# Altium project MOTORCONTROL.BLDC.REGENBRAKING.PrjPcb
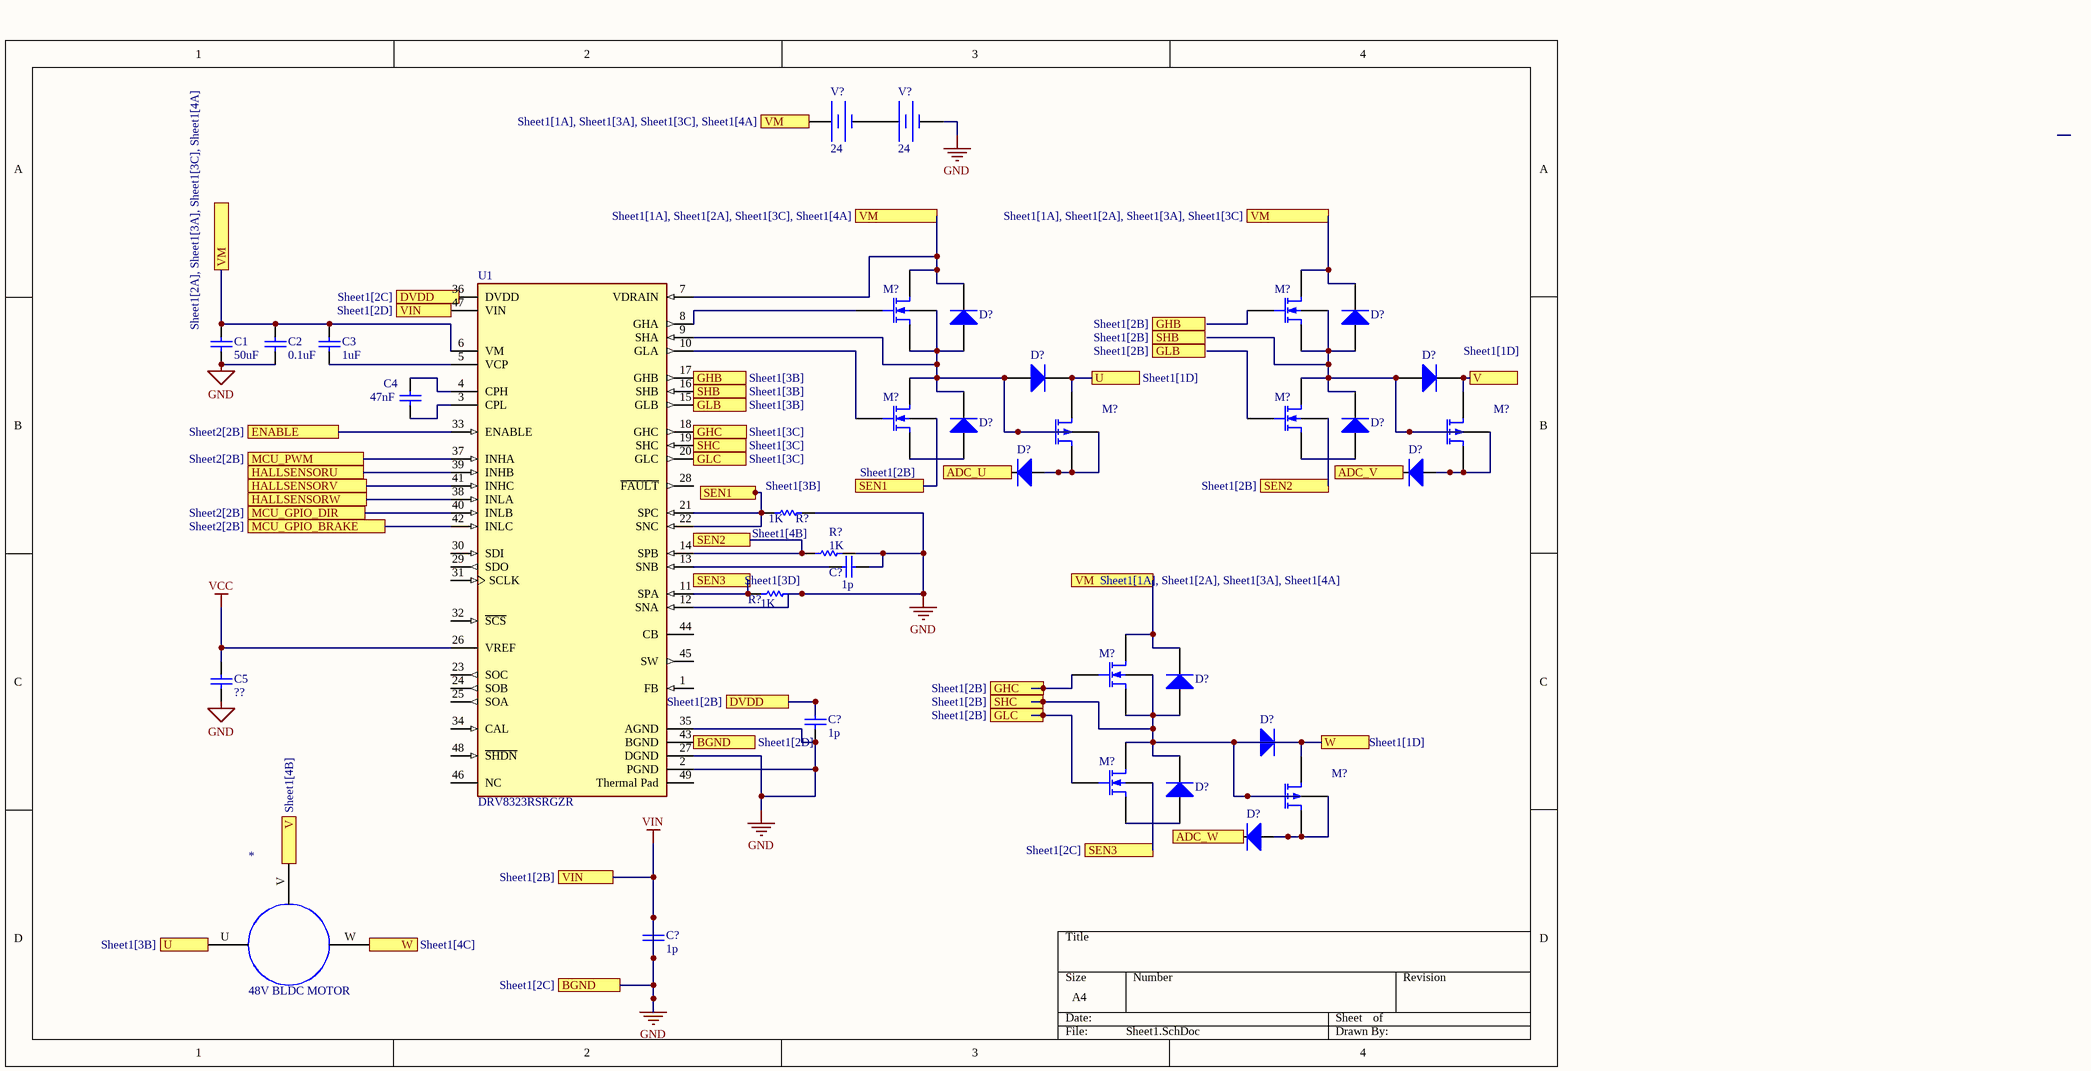
[diagram p0: Sheet1.SchDoc]
2 sheets, 37 parts. Net scope: flat (ports and power ports of the same name join across sheets).
Sheets:
  Sheet1.SchDoc
  Sheet2.SchDoc

## Sheet Sheet1.SchDoc
size A4; SheetNumber: 1; SheetTotal: 1

### Parts
(Parts that share a designator on the sheet are numbered #1, #2 ... from top to bottom, then left to right.)
*  48V BLDC MOTOR
C1  value 50uF  (hidden comment: Capacitor)
C2  value 0.1uF  (hidden comment: Capacitor)
C3  value 1uF  (hidden comment: Capacitor)
C4  value 47nF  (hidden comment: Capacitor)
C5  value ??  (hidden comment: Capacitor)
C?#1  value 1p  (hidden comment: Capacitor)
C?#2  value 1p  (hidden comment: Capacitor)
C?#3  value 1p  (hidden comment: Capacitor)
D?#1  Diode  (value not drawn)
D?#2  Diode  (value not drawn)
D?#3  Diode  (value not drawn)
D?#4  Diode  (value not drawn)
D?#5  Diode  (value not drawn)
D?#6  Diode  (value not drawn)
D?#7  Diode  (value not drawn)
D?#8  Diode  (value not drawn)
D?#9  Diode  (value not drawn)
D?#10  Diode  (value not drawn)
D?#11  Diode  (value not drawn)
D?#12  Diode  (value not drawn)
M?#1  N-channel MOSFET MOS9 Model  (value not drawn)
M?#2  N-channel MOSFET MOS9 Model  (value not drawn)
M?#3  N-channel MOSFET MOS9 Model  (value not drawn)
M?#4  N-channel MOSFET MOS9 Model  (value not drawn)
M?#5  P-channel MOS1 MOSFET Shichman and Hodges Model  (value not drawn)
M?#6  P-channel MOS1 MOSFET Shichman and Hodges Model  (value not drawn)
M?#7  N-channel MOSFET MOS9 Model  (value not drawn)
M?#8  N-channel MOSFET MOS9 Model  (value not drawn)
M?#9  P-channel MOS1 MOSFET Shichman and Hodges Model  (value not drawn)
R?#1  value 1K  (hidden comment: Resistor)
R?#2  value 1K  (hidden comment: Resistor)
R?#3  value 1K  (hidden comment: Resistor)
U1  DRV8323RSRGZR  [FP-RGZ0048A-IPC_A]
V?#1  DC Magnitude: 24  (hidden comment: Constant Voltage Source)
V?#2  DC Magnitude: 24  (hidden comment: Constant Voltage Source)

### Ports
ADC_U, ADC_V, ADC_W, BGND (see Sheet1[2C]), BGND (see Sheet1[2D]), DVDD (see Sheet1[2B]), DVDD (see Sheet1[2C]), ENABLE (see Sheet2[2B]), GHB (see Sheet1[2B]), GHB (see Sheet1[3B]), GHC (see Sheet1[2B]), GHC (see Sheet1[3C]), GLB (see Sheet1[2B]), GLB (see Sheet1[3B]), GLC (see Sheet1[2B]), GLC (see Sheet1[3C]), HALLSENSORU, HALLSENSORV, HALLSENSORW, MCU_GPIO_BRAKE (see Sheet2[2B]), MCU_GPIO_DIR (see Sheet2[2B]), MCU_PWM (see Sheet2[2B]), SEN1 (see Sheet1[2B]), SEN1 (see Sheet1[3B]), SEN2 (see Sheet1[2B]), SEN2 (see Sheet1[4B]), SEN3 (see Sheet1[2C]), SEN3 (see Sheet1[3D]), SHB (see Sheet1[2B]), SHB (see Sheet1[3B]), SHC (see Sheet1[2B]), SHC (see Sheet1[3C]), U (see Sheet1[1D]), U (see Sheet1[3B]), V (see Sheet1[1D]), V (see Sheet1[4B]), VIN (see Sheet1[2B]), VIN (see Sheet1[2D]), VM (see Sheet1[1A], Sheet1[2A], Sheet1[3A], Sheet1[3C]), VM (see Sheet1[1A], Sheet1[2A], Sheet1[3A], Sheet1[4A]), VM (see Sheet1[1A], Sheet1[2A], Sheet1[3C], Sheet1[4A]), VM (see Sheet1[1A], Sheet1[3A], Sheet1[3C], Sheet1[4A]), VM (see Sheet1[2A], Sheet1[3A], Sheet1[3C], Sheet1[4A]), W (see Sheet1[1D]), W (see Sheet1[4C])

### Nets
GND: C1.1 C2.1 C5.1 C?#1.2 C?#2.1 C?#3.1 C?#3.2 R?#1.2 R?#2.2 R?#3.2 U1.2(PGND) U1.12(SNA) U1.27(DGND) U1.35(AGND) U1.43(BGND) U1.47(VIN) V?#2.2 ; port BGND, port VIN  [also labelled VIN]
VCC: C5.2 U1.26(VREF)
NetC1_2: C1.2 C2.2 C3.2 D?#1.2(K) D?#2.2(K) D?#9.2(K) M?#1.1(D) M?#2.1(D) M?#7.1(D) U1.6(VM) U1.7(VDRAIN) V?#1.1 ; port VM
NetC3_1: C3.1 U1.5(VCP)
NetC4_1: C4.1 U1.3(CPL)
NetC4_2: C4.2 U1.4(CPH)
NetC?#1_1: C?#1.1 U1.13(SNB)
NetC?#2_2: C?#2.2 ; port DVDD
NetD?#1_1: D?#1.1(A) D?#3.1(A) D?#5.2(K) M?#1.3(S) M?#1.4(B) M?#3.1(D) M?#5.2(G) U1.9(SHA)
NetD?#2_1: D?#2.1(A) D?#4.1(A) D?#6.2(K) M?#2.3(S) M?#2.4(B) M?#4.1(D) M?#6.2(G)
NetD?#3_2: D?#3.2(K) M?#5.1(D) ; port U
NetD?#4_2: D?#4.2(K) M?#6.1(D) ; port V
NetD?#5_1: D?#5.1(A) M?#3.3(S)
NetD?#6_1: D?#6.1(A) M?#4.3(S)
NetD?#7_1: D?#7.1(A) M?#5.3(S) M?#5.4(B)
NetD?#8_1: D?#8.1(A) M?#6.3(S) M?#6.4(B)
NetD?#9_1: D?#9.1(A) D?#10.1(A) D?#10.2(K) D?#11.2(K) M?#7.3(S) M?#7.4(B) M?#8.1(D) M?#9.1(D) M?#9.2(G) U1.19(SHC) ; port SHC, port W
NetD?#11_1: D?#11.1(A) M?#8.3(S)
NetD?#12_1: D?#12.1(A) M?#9.3(S) M?#9.4(B)
NetM?#1_2: M?#1.2(G) U1.8(GHA)
NetM?#3_2: M?#3.2(G) U1.10(GLA)
NetM?#3_4: M?#3.4(B) R?#1.1 U1.21(SPC) U1.22(SNC) ; port SEN1
NetM?#4_4: M?#4.4(B) R?#2.1 U1.14(SPB) ; port SEN2
NetM?#7_2: M?#7.2(G) U1.18(GHC) ; port GHC
NetM?#8_2: M?#8.2(G) U1.20(GLC) ; port GLC
NetM?#8_4: M?#8.4(B) R?#3.1 U1.11(SPA) ; port SEN3
NetU1_15: U1.15(GLB) ; port GLB
NetU1_16: U1.16(SHB) ; port SHB
NetU1_17: U1.17(GHB) ; port GHB
NetU1_33: U1.33(ENABLE) ; port ENABLE
NetU1_37: U1.37(INHA) ; port MCU_PWM
NetU1_38: U1.38(INLA) ; port HALLSENSORW
NetU1_39: U1.39(INHB) ; port HALLSENSORU
NetU1_40: U1.40(INLB) ; port MCU_GPIO_DIR
NetU1_41: U1.41(INHC) ; port HALLSENSORV
NetU1_42: U1.42(INLC) ; port MCU_GPIO_BRAKE
NetV?#1_2: V?#1.2 V?#2.1

Not connected (* = marked no-connect by the designer): * U(25) V(U) W(26); D?#7 2(K); D?#8 2(K); D?#12 2(K); M?#2 2(G); M?#4 2(G); U1 1(FB) 23(SOC) 24(SOB) 25(SOA) 28(~{FAULT}) 29(SDO) 30(SDI) 31(SCLK) 32(~{SCS}) 34(CAL) 36(DVDD) 44(CB) 45(SW) 46(NC) 48(~{SHDN}) 49(Thermal_Pad)

### Library data of the parts
C1-C5 C?#1-C?#3 = Capacitor: SimulationGenericComponent: True
D?#1-D?#12 = Diode: AF: 1; BV: 0; BV_MAX: 1e99; EG: 1.11; FC: 0.5; IBV: 0.001; ISR: 1e-14; MJSW: 0.33; NTUN: 30; TNOM: 27; XTI: 3; SimulationGenericComponent: True; CJO: 0; CJP: 0; CTA: 0; CTP: 0; FCS: 0.5; FV_MAX: 1e99; IKF: 0; IKR: 0; JSW: 0; JTUN: 0; JTUNSW: 0; KEG: 1; KF: 0; LEVEL: 1; N: 1; NBV: 1; NR: 1; NS: 1; PHP: 1; RS: 0; TCV: 0; TLEV: 0; TLEVC: 0; TM1: 0; TM2: 0; TPB: 0; TPHP: 0; TRS: 0; TRS2: 0; TT: 0; TTT1: 0; TTT2: 0; VJ: 1; XTITUN: 3; IS: 1e-14
M?#1-M?#4 M?#7 M?#8 = MOSFET N-ch Lev9: AF: 1; ALPHA: 0; FC: 0.5; IS: 1e-14; KAPPA: 0.2; KP: 2.07189e-05; MJSW: 0.33; PB: 0.8; PHI: 0.6; TNOM: 27; TOX: 1e-07; U0: 600; SimulationGenericComponent: True; CBD: 0; CBS: 0; CGBO: 0; CGDO: 0; CGSO: 0; CJ: 0; CJSW: 0; DELTA: 0; DELVTO: 0; ETA: 0; GAMMA: 0; INPUT_DELTA: 0; JS: 0; KF: 0; LD: 0; MJ: 0.5; NFS: 0; NSS: 0; NSUB: 0; RD: 0; RS: 0; RSH: 0; THETA: 0; TPG: 0; VMAX: 0; VTO: 0; WD: 0; XD: 0; XJ: 0; XL: 0; XW: 0
M?#5 M?#6 M?#9 = MOSFET P-ch Lev1: CBD: 0; FC: 0.5; IS: 1e-14; KP: 2e-05; PB: 0.8; PHI: 0.6; TNOM: 27; SimulationGenericComponent: True; CBS: 0; CGBO: 0; CGDO: 0; CGSO: 0; CJ: 0; CJSW: 0; GAMMA: 0; JS: 0; LAMBDA: 0; LD: 0; MJ: 0.5; MJSW: 0.5; NSS: 0; NSUB: 0; RD: 0; RS: 0; RSH: 0; TOX: 0; TPG: 0; U0: 0; VTO: 0
R?#1-R?#3 = Resistor: TC1: 0; SimulationGenericComponent: True; TC2: 0
U1 = CMP-04915-000002-1: IC MTR DRV MULTIPHAS 6-60V 48QFN; Manufacturer: Texas Instruments; Min Supply Voltage: 4V; Switching Frequency: 700kHz; Nominal Supply Current: 10.5mA; Max Supply Voltage: 60V; Standoff Height: 0mm; Motor Type: Brushless DC; Output Current: 5mA; Max Junction Temp: +150°C; Category: IC; Digikey Description: IC MTR DRV MULTIPHAS 6-60V 48QFN; Height: 1mm; Lead Free: Yes; Device Class L1: Integrated Circuits (ICs); ComponentLink2Description: Datasheet; Manufacturer Part Number: DRV8323RSRGZR; RoHS: TRUE; ComponentLink2URL: http://www.ti.com/lit/ds/symlink/drv8323r.pdf; Ambient Temperature Range Low: -40°C; Octopart: https://octopart.com/drv8323rsrgzr-texas+instruments-80665177; Ambient Temperature Range High: +125°C; Temperature Range Low: -40°C; Temperature Range High: +125°C; Device Class L3: Motor Drivers; Package: RGZ0048A; Automotive: No; Device Class L2: Power Management ICs; Temperature: -40°C to +125°C; Mouser Description: Triple Half Bridge Motor Driver 48-Pin VQFN EP T/R
V?#1 V?#2 = Battery: SimulationGenericComponent: True

## Sheet Sheet2.SchDoc
size A4; SheetNumber: 2; SheetTotal: 2
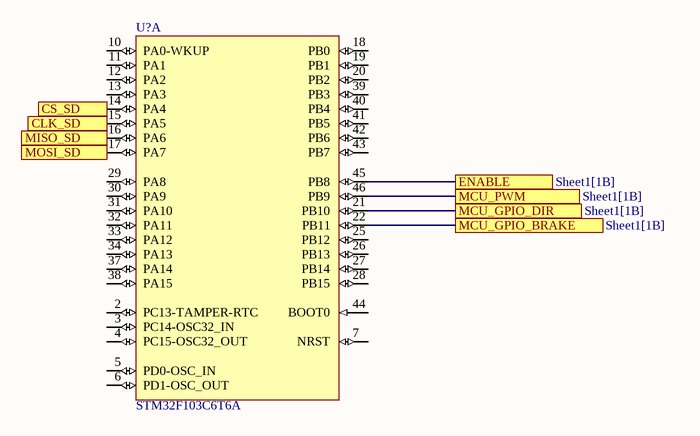
[diagram p1: Sheet2.SchDoc]

### Parts
U?  STM32F103C6T6A  [STM-LQFP48_L]  (part A of 2)

### Ports
CLK_SD, CS_SD, ENABLE (see Sheet1[1B]), MCU_GPIO_BRAKE (see Sheet1[1B]), MCU_GPIO_DIR (see Sheet1[1B]), MCU_PWM (see Sheet1[1B]), MISO_SD, MOSI_SD

### Nets
NetU1_33: U?.45(PB8) ; port ENABLE
NetU1_37: U?.46(PB9) ; port MCU_PWM
NetU1_40: U?.21(PB10) ; port MCU_GPIO_DIR
NetU1_42: U?.22(PB11) ; port MCU_GPIO_BRAKE
NetU?_14: U?.14(PA4) ; port CS_SD
NetU?_15: U?.15(PA5) ; port CLK_SD
NetU?_16: U?.16(PA6) ; port MISO_SD
NetU?_17: U?.17(PA7) ; port MOSI_SD

Not connected (* = marked no-connect by the designer): U? 2(PC13-TAMPER-RTC) 3(PC14-OSC32_IN) 4(PC15-OSC32_OUT) 5(PD0-OSC_IN) 6(PD1-OSC_OUT) 7(NRST) 10(PA0-WKUP) 11(PA1) 12(PA2) 13(PA3) 18(PB0) 19(PB1) 20(PB2) 25(PB12) 26(PB13) 27(PB14) 28(PB15) 29(PA8) 30(PA9) 31(PA10) 32(PA11) 33(PA12) 34(PA13) 37(PA14) 38(PA15) 39(PB3) 40(PB4) 41(PB5) 42(PB6) 43(PB7) 44(BOOT0)

### Library data of the parts
U? = CMP-0237-00254-3: ARM Cortex-M3 32-bit MCU, 32 KB Flash, 10 KB Internal RAM, 37 I/Os, 48-pin LQFP, -40 to 85 degC, Tray; Operating Frequency(F) (Processor speed) (MHz): 72; A/D Converter: 2x12-bit (10 Channel); Supply Voltage(Vcc) min (V): 2; FLASH Size (Prog) (kB): 32; I/Os (High Current): 37; Internal RAM Size (kB): 10; PackageVersion: Rev. 6, 06/2013; ComponentLink3Description: Package Specification; ComponentLink2URL: http://www.st.com/st-web-ui/static/active/en/resource/technical/document/datasheet/CD00210843.pdf; ComponentLink1URL: http://www.st.com/web/en/home.html; PackageDescription: 48-Pin Low Profile Quad Flat Package, 7 x 7 mm Body, 0.5 mm Pitch; PartNumber: STM32F103C6T6A; ComponentLink3URL: http://www.st.com/st-web-ui/static/active/en/resource/technical/document/datasheet/DM00058181.pdf; PackageReference: LQFP48; Packing: Tray; ComponentLink2Description: Datasheet; Mounting Technology: Surface Mount; ComponentLink1Description: Manufacturer URL; Core: ARM Cortex-M3; DatasheetVersion: Rev. 6

## Nets that join several sheets
NetU1_33: Sheet1 (U1.33), Sheet2 (U?.45)
NetU1_37: Sheet1 (U1.37), Sheet2 (U?.46)
NetU1_40: Sheet1 (U1.40), Sheet2 (U?.21)
NetU1_42: Sheet1 (U1.42), Sheet2 (U?.22)